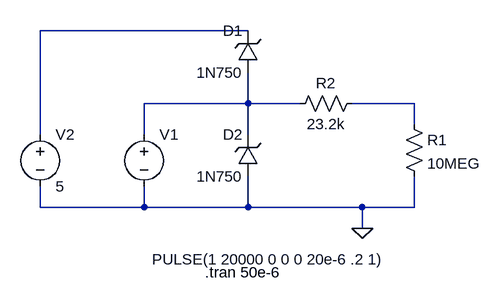
[diagram p0: schematic esd_analog_input.asc]
esd_analog_input.asc, the LTspice schematic file:
Version 4
SHEET 1 880 680
WIRE -16 0 -336 0
WIRE -16 112 -16 64
WIRE -16 112 -176 112
WIRE 64 112 -16 112
WIRE 240 112 144 112
WIRE 240 144 240 112
WIRE -336 160 -336 0
WIRE -176 160 -176 112
WIRE -16 160 -16 112
WIRE -336 272 -336 240
WIRE -176 272 -176 240
WIRE -176 272 -336 272
WIRE -16 272 -16 224
WIRE -16 272 -176 272
WIRE 160 272 -16 272
WIRE 240 272 240 224
WIRE 240 272 160 272
WIRE 160 304 160 272
FLAG 160 304 0
SYMBOL voltage -176 144 R0
WINDOW 3 12 208 Left 2
WINDOW 123 0 0 Left 2
WINDOW 39 0 0 Left 2
SYMATTR InstName V1
SYMATTR Value PULSE(1 20000 0 0 0 20e-6 .2 1)
SYMBOL res 160 96 R90
WINDOW 0 0 56 VBottom 2
WINDOW 3 32 56 VTop 2
SYMATTR InstName R2
SYMATTR Value 23.2k
SYMBOL res 224 128 R0
SYMATTR InstName R1
SYMATTR Value 10MEG
SYMBOL zener 0 224 R180
WINDOW 0 24 64 Left 2
WINDOW 3 24 0 Left 2
SYMATTR InstName D2
SYMATTR Value 1N750
SYMATTR Description Diode
SYMATTR Type diode
SYMBOL voltage -336 144 R0
WINDOW 123 0 0 Left 2
WINDOW 39 0 0 Left 2
SYMATTR InstName V2
SYMATTR Value 5
SYMBOL zener 0 64 R180
WINDOW 0 24 64 Left 2
WINDOW 3 24 0 Left 2
SYMATTR InstName D1
SYMATTR Value 1N750
SYMATTR Description Diode
SYMATTR Type diode
TEXT -82 372 Left 2 !.tran 50e-6

The netlist it stands for:
* esd_analog_input.asc
V1 N002 0 PULSE(1 20000 0 0 0 20e-6 .2 1)
R2 N003 N002 23.2k
R1 N003 0 10MEG
D2 0 N002 1N750
V2 N001 0 5
D1 N002 N001 1N750
.model D D
.lib standard.dio
.tran 50e-6
.backanno
.end